# EAGLE design freesoc_1.0 (EAGLE 6.2)
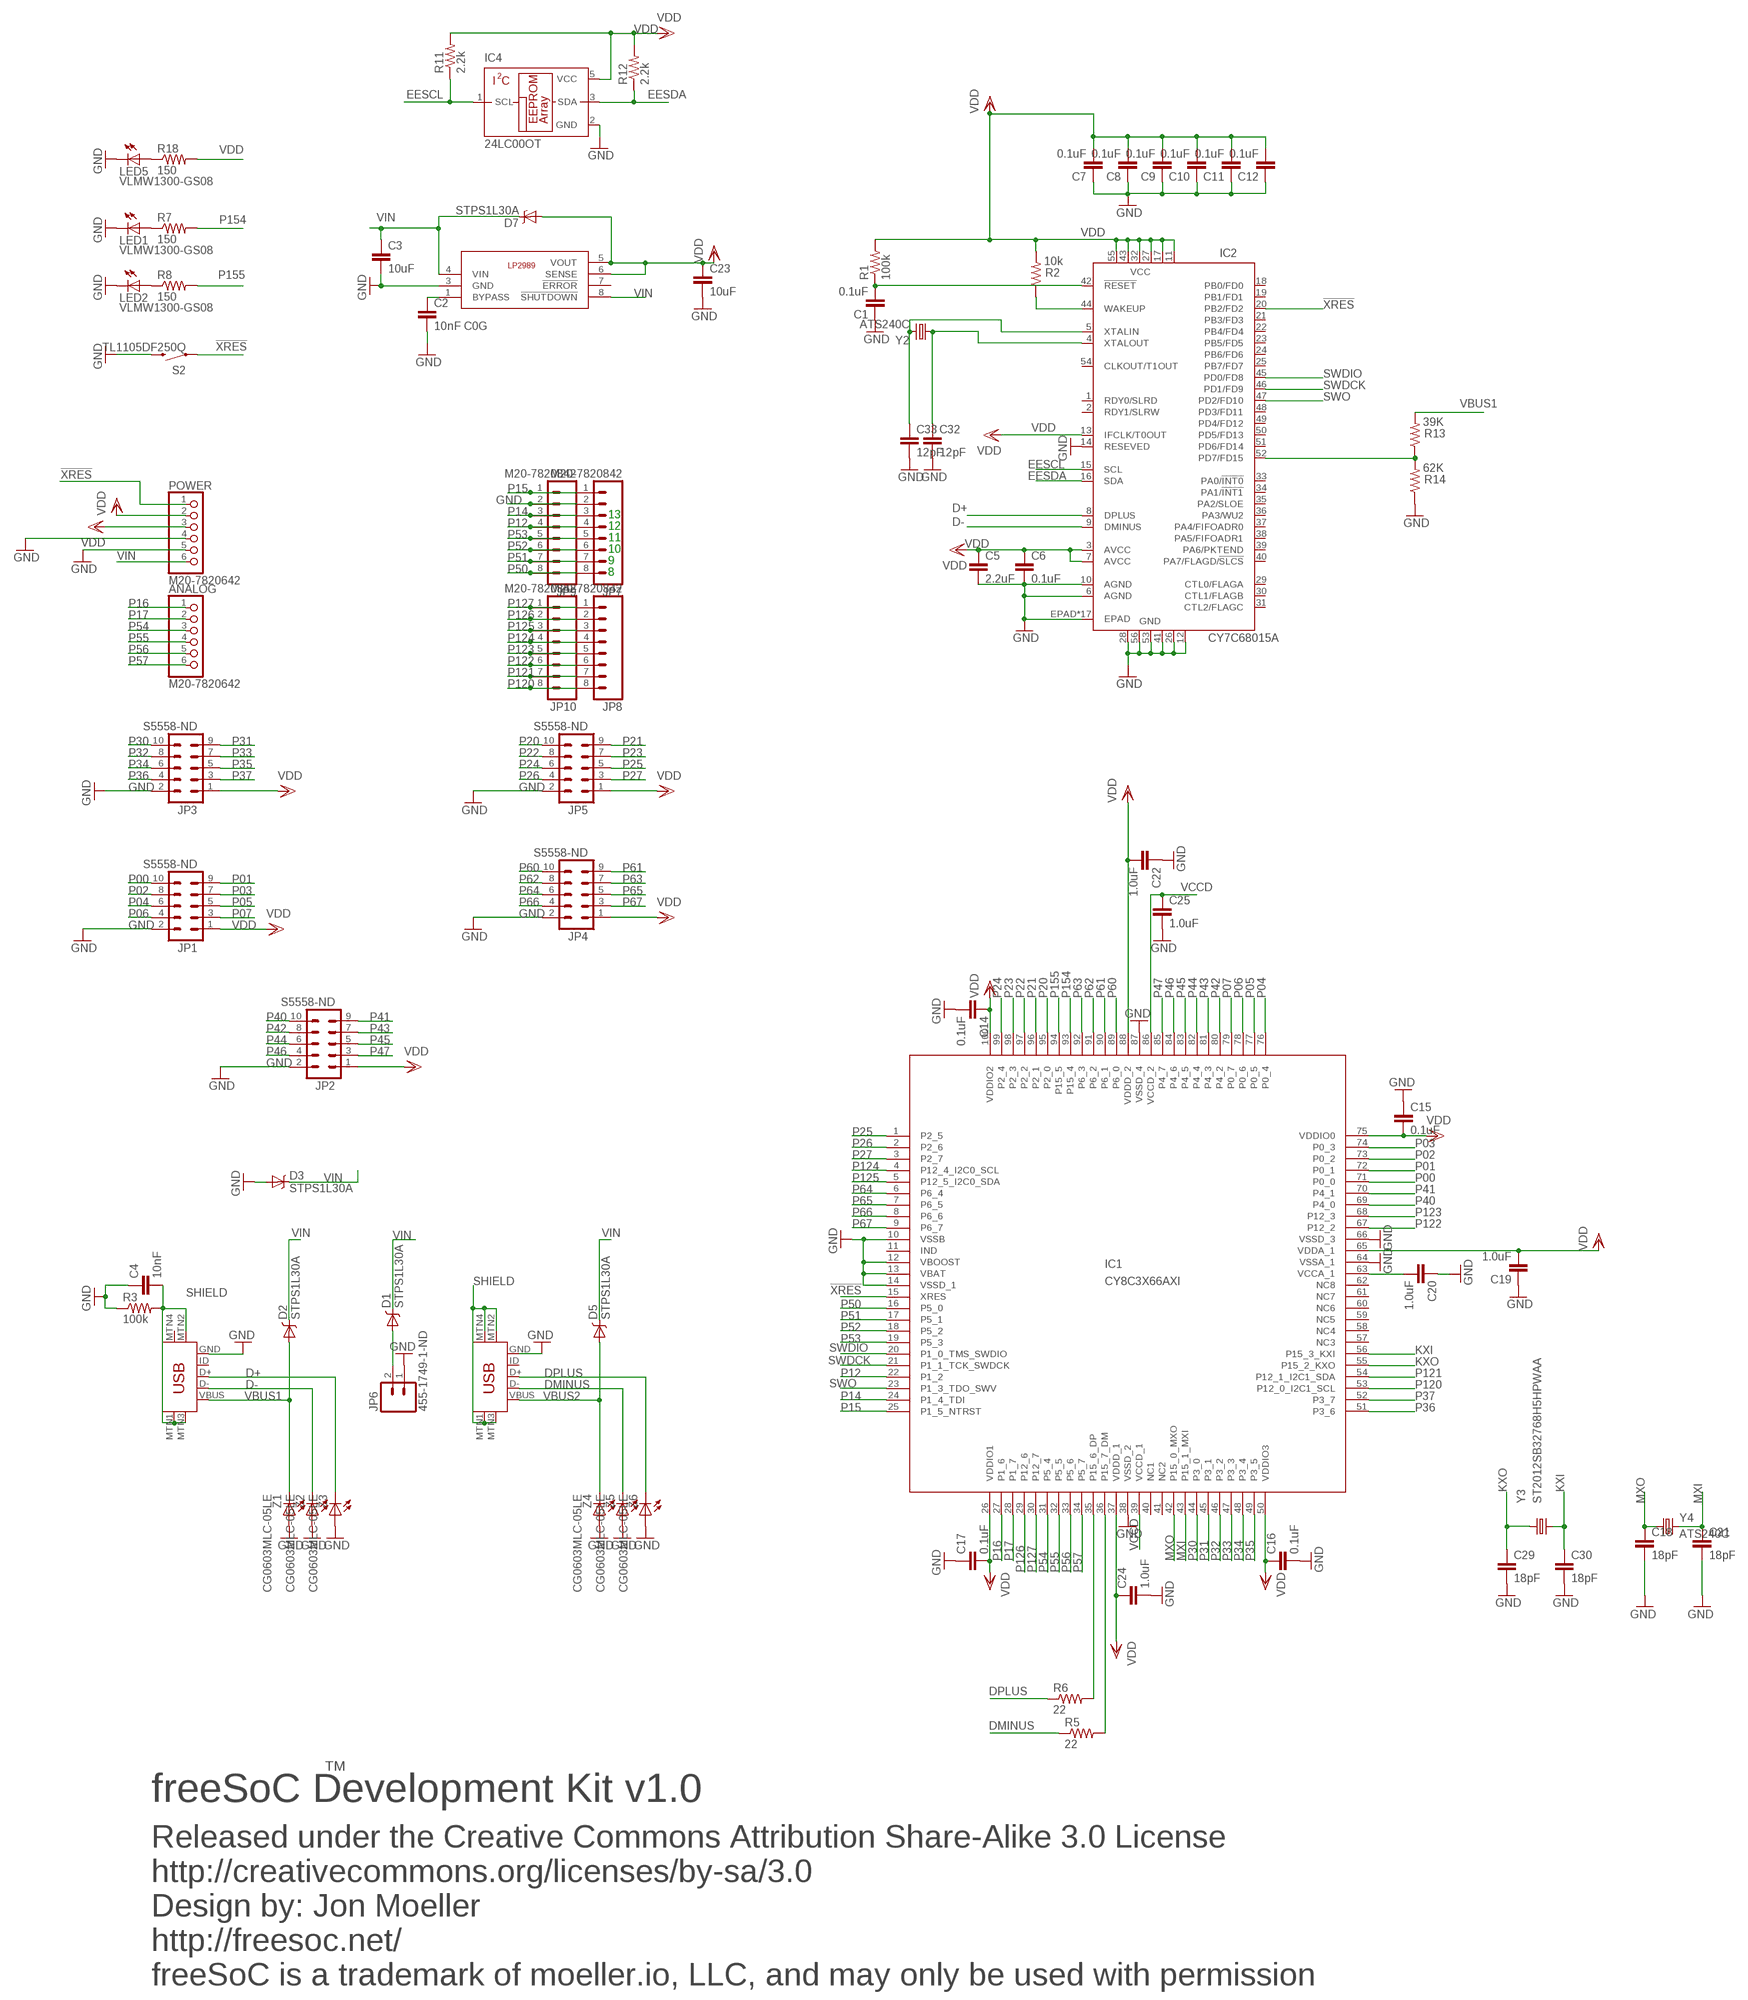
[diagram p0: schematic, sheet 1]

## Parts
ANALOG  M20-7820642  PINHD-1X6  [1X06]
C1  0.1uF  CAP0402-CAP  [0402-CAP]
C2  10nF C0G  CAP0402-CAP  [0402-CAP]
C3  10uF  CAP1206  [1206]
C4  10nF  CAP0402-CAP  [0402-CAP]
C5  2.2uF  CAP0603-CAP  [0603-CAP]
C6  0.1uF  CAP0402-CAP  [0402-CAP]
C7  0.1uF  CAP0402-CAP  [0402-CAP]
C8  0.1uF  CAP0402-CAP  [0402-CAP]
C9  0.1uF  CAP0402-CAP  [0402-CAP]
C10  0.1uF  CAP0402-CAP  [0402-CAP]
C11  0.1uF  CAP0402-CAP  [0402-CAP]
C12  0.1uF  CAP0402-CAP  [0402-CAP]
C14  0.1uF  CAP0402-CAP  [0402-CAP]
C15  0.1uF  CAP0402-CAP  [0402-CAP]
C16  0.1uF  CAP0402-CAP  [0402-CAP]
C17  0.1uF  CAP0402-CAP  [0402-CAP]
C18  18pF  CAP0402-CAP  [0402-CAP]
C19  1.0uF  CAP0402-CAP  [0402-CAP]
C20  1.0uF  CAP0402-CAP  [0402-CAP]
C21  18pF  CAP0402-CAP  [0402-CAP]
C22  1.0uF  CAP0402-CAP  [0402-CAP]
C23  10uF  CAP1206  [1206]
C24  1.0uF  CAP0402-CAP  [0402-CAP]
C25  1.0uF  CAP0402-CAP  [0402-CAP]
C29  18pF  CAP0402-CAP  [0402-CAP]
C30  18pF  CAP0402-CAP  [0402-CAP]
C32  12pF  CAP0402-CAP  [0402-CAP]
C33  12pF  CAP0402-CAP  [0402-CAP]
D1  STPS1L30A  DIODE-SCHOTTKY_  [SMA-DIODE]
D2  STPS1L30A  DIODE-SCHOTTKY_  [SMA-DIODE]
D3  STPS1L30A  DIODE-SCHOTTKY_  [SMA-DIODE]
D5  STPS1L30A  DIODE-SCHOTTKY_  [SMA-DIODE]
D7  STPS1L30A  DIODE-SCHOTTKY_  [SMA-DIODE]
IC1  CY8C3X66AXI  [TQFP-100]
IC2  CY7C68015A  CY7C68015A-56QFNLFXC  [QFN56]
IC4  24LC00OT  [SOT23-5L]
JP1  S5558-ND  M05X2RAF  [2X5-RAF]
JP2  S5558-ND  M05X2RAF  [2X5-RAF]
JP3  S5558-ND  M05X2RAF  [2X5-RAF]
JP4  S5558-ND  M05X2RAF  [2X5-RAF]
JP5  S5558-ND  M05X2RAF  [2X5-RAF]
JP6  455-1749-1-ND  M02-JST-2MM-SMT  [JST-2-SMD]
JP7  M20-7820842  M081X08  [1X08]
JP8  M20-7820842  M081X08  [1X08]
JP9  M20-7820842  M081X08  [1X08]
JP10  M20-7820842  M081X08  [1X08]
LED1  VLMW1300-GS08  LED0603  [LED-0603]
LED2  VLMW1300-GS08  LED0603  [LED-0603]
LED5  VLMW1300-GS08  LED0603  [LED-0603]
POWER  M20-7820642  PINHD-1X6  [1X06]
R1  100k  RESISTOR0402-RES  [0402-RES]
R2  10k  RESISTOR0402-RES  [0402-RES]
R3  100k  RESISTOR0402-RES  [0402-RES]
R5  22  RESISTOR0805-RES  [0805]
R6  22  RESISTOR0805-RES  [0805]
R7  150  RESISTOR0603-RES  [0603-RES]
R8  150  RESISTOR0603-RES  [0603-RES]
R11  2.2k  RESISTOR0402-RES  [0402-RES]
R12  2.2k  RESISTOR0402-RES  [0402-RES]
R13  39K  RESISTOR0402-RES  [0402-RES]
R14  62K  RESISTOR0402-RES  [0402-RES]
R18  150  RESISTOR0603-RES  [0603-RES]
S2  TL1105DF250Q  SWITCH-MOMENTARY-2PTH  [TACTILE-PTH]
U$1  LP2989  [SO08]
U$5  USB-MINIB-5PIN  [USB-MINIB]
U$6  USB-MINIB-5PIN  [USB-MINIB]
Y2  ATS240C  CRYSTALHC49US  [HC49US]
Y3  ST2012SB32768H5HPWAA  CRYSTALST2012B  [ST2012B]
Y4  ATS240C  CRYSTALHC49US  [HC49US]
Z1  CG0603MLC-05LE  LED0603  [LED-0603]
Z2  CG0603MLC-05LE  LED0603  [LED-0603]
Z3  CG0603MLC-05LE  LED0603  [LED-0603]
Z4  CG0603MLC-05LE  LED0603  [LED-0603]
Z5  CG0603MLC-05LE  LED0603  [LED-0603]
Z6  CG0603MLC-05LE  LED0603  [LED-0603]

## Nets
!XRES: IC1.15(XRES) IC2.20(PB2/FD2) POWER.1 S2.1
D+: IC2.8(DPLUS) U$5.D+ Z3.C
D-: IC2.9(DMINUS) U$5.D- Z2.C
DMINUS: R5.1 U$6.D- Z5.C
DPLUS: R6.1 U$6.D+ Z6.C
EESCL: IC2.15(SCL) IC4.1(SCL) R11.1
EESDA: IC2.16(SDA) IC4.3(SDA) R12.1
GND: C1.1 C2.2 C3.2 C4.1 C5.2 C6.2 C7.1 C8.1 C9.1 C10.1 C11.1 C12.1 C14.2 C15.1 C16.2 C17.1 C18.2 C19.1 C20.1 C21.2 C22.1 C23.2 C24.2 C25.2 C29.2 C30.2 C32.2 C33.2 D3.A IC1.10(VSSB) IC1.12(VBOOST) IC1.13(VBAT) IC1.14(VSSD_1) IC1.38(VSSD_2) IC1.64(VSSA_1) IC1.66(VSSD_3) IC1.87(VSSD_4) IC2.6(AGND) IC2.10(AGND) IC2.12(GND) IC2.14(RESEVED) IC2.26(GND) IC2.28(GND) IC2.41(GND) IC2.53(GND) IC2.56(GND) IC2.EPAD IC2.P$1(EPAD) IC2.P$2(EPAD) IC2.P$3(EPAD) IC2.P$4(EPAD) IC2.P$5(EPAD) IC2.P$6(EPAD) IC2.P$7(EPAD) IC2.P$8(EPAD) IC2.P$9(EPAD) IC2.P$10(EPAD) IC2.P$11(EPAD) IC2.P$12(EPAD) IC2.P$13(EPAD) IC2.P$14(EPAD) IC2.P$15(EPAD) IC2.P$16(EPAD) IC4.2(GND) JP1.2 JP2.2 JP3.2 JP4.2 JP5.2 JP6.1 JP7.2 JP9.2 LED1.C LED2.C LED5.C POWER.4 POWER.5 R3.1 R14.1 S2.3 U$1.3(GND) U$5.GND U$6.GND Z1.A Z2.A Z3.A Z4.A Z5.A Z6.A
KXI: C30.1 IC1.56(P15_3_KXI) Y3.P$2
KXO: C29.1 IC1.55(P15_2_KXO) Y3.P$1
MXI: C21.1 IC1.43(P15_1_MXI) Y4.2
MXO: C18.1 IC1.42(P15_0_MXO) Y4.1
N$1: C1.2 IC2.42(!RESET) R1.1
N$2: D1.A JP6.2
N$5: IC2.44(WAKEUP) R2.1
N$7: C20.2 IC1.63(VCCA_1)
N$8: IC1.35(P15_6_DP) R6.2
N$9: IC1.36(P15_7_DM) R5.2
N$11: LED1.A R7.1
N$12: LED2.A R8.1
N$13: C2.1 U$1.1(BYPASS)
N$15: IC2.52(PD7/FD15) R13.1 R14.2
N$18: LED5.A R18.1
P00: IC1.71(P0_0) JP1.10
P01: IC1.72(P0_1) JP1.9
P02: IC1.73(P0_2) JP1.8
P03: IC1.74(P0_3) JP1.7
P04: IC1.76(P0_4) JP1.6
P05: IC1.77(P0_5) JP1.5
P06: IC1.78(P0_6) JP1.4
P07: IC1.79(P0_7) JP1.3
P12: IC1.22(P1_2) JP7.4 JP9.4
P14: IC1.24(P1_4_TDI) JP7.3 JP9.3
P15: IC1.25(P1_5_NTRST) JP7.1 JP9.1
P16: ANALOG.1 IC1.27(P1_6)
P17: ANALOG.2 IC1.28(P1_7)
P20: IC1.95(P2_0) JP5.10
P21: IC1.96(P2_1) JP5.9
P22: IC1.97(P2_2) JP5.8
P23: IC1.98(P2_3) JP5.7
P24: IC1.99(P2_4) JP5.6
P25: IC1.1(P2_5) JP5.5
P26: IC1.2(P2_6) JP5.4
P27: IC1.3(P2_7) JP5.3
P30: IC1.44(P3_0) JP3.10
P31: IC1.45(P3_1) JP3.9
P32: IC1.46(P3_2) JP3.8
P33: IC1.47(P3_3) JP3.7
P34: IC1.48(P3_4) JP3.6
P35: IC1.49(P3_5) JP3.5
P36: IC1.51(P3_6) JP3.4
P37: IC1.52(P3_7) JP3.3
P40: IC1.69(P4_0) JP2.10
P41: IC1.70(P4_1) JP2.9
P42: IC1.80(P4_2) JP2.8
P43: IC1.81(P4_3) JP2.7
P44: IC1.82(P4_4) JP2.6
P45: IC1.83(P4_5) JP2.5
P46: IC1.84(P4_6) JP2.4
P47: IC1.85(P4_7) JP2.3
P50: IC1.16(P5_0) JP7.8 JP9.8
P51: IC1.17(P5_1) JP7.7 JP9.7
P52: IC1.18(P5_2) JP7.6 JP9.6
P53: IC1.19(P5_3) JP7.5 JP9.5
P54: ANALOG.3 IC1.31(P5_4)
P55: ANALOG.4 IC1.32(P5_5)
P56: ANALOG.5 IC1.33(P5_6)
P57: ANALOG.6 IC1.34(P5_7)
P60: IC1.89(P6_0) JP4.10
P61: IC1.90(P6_1) JP4.9
P62: IC1.91(P6_2) JP4.8
P63: IC1.92(P6_3) JP4.7
P64: IC1.6(P6_4) JP4.6
P65: IC1.7(P6_5) JP4.5
P66: IC1.8(P6_6) JP4.4
P67: IC1.9(P6_7) JP4.3
P120: IC1.53(P12_0_I2C1_SCL) JP8.8 JP10.8
P121: IC1.54(P12_1_I2C1_SDA) JP8.7 JP10.7
P122: IC1.67(P12_2) JP8.6 JP10.6
P123: IC1.68(P12_3) JP8.5 JP10.5
P124: IC1.4(P12_4_I2C0_SCL) JP8.4 JP10.4
P125: IC1.5(P12_5_I2C0_SDA) JP8.3 JP10.3
P126: IC1.29(P12_6) JP8.2 JP10.2
P127: IC1.30(P12_7) JP8.1 JP10.1
P154: IC1.93(P15_4) R7.2
P155: IC1.94(P15_5) R8.2
SHIELD: C4.2 R3.2 U$5.MTN1(MTN2) U$5.MTN2(MTN3) U$5.MTN3(MTN1) U$6.MTN1(MTN2) U$6.MTN2(MTN3) U$6.MTN3(MTN1) U$6.MTN4
SWDCK: IC1.21(P1_1_TCK_SWDCK) IC2.46(PD1/FD9)
SWDIO: IC1.20(P1_0_TMS_SWDIO) IC2.45(PD0/FD8)
SWO: IC1.23(P1_3_TDO_SWV) IC2.47(PD2/FD10)
VBUS1: D2.A R13.2 U$5.VBUS Z1.C
VBUS2: D5.A U$6.VBUS Z4.C
VCCD: C25.1 IC1.39(VCCD_1) IC1.86(VCCD_2)
VDD: C5.1 C6.1 C7.2 C8.2 C9.2 C10.2 C11.2 C12.2 C14.1 C15.2 C16.1 C17.2 C19.2 C22.2 C23.1 C24.1 D7.A IC1.26(VDDIO1) IC1.37(VDDD_1) IC1.50(VDDIO3) IC1.65(VDDA_1) IC1.75(VDDIO0) IC1.88(VDDD_2) IC1.100(VDDIO2) IC2.3(AVCC) IC2.7(AVCC) IC2.11(VCC) IC2.13(IFCLK/T0OUT) IC2.17(VCC) IC2.27(VCC) IC2.32(VCC) IC2.43(VCC) IC2.55(VCC) IC4.5(VCC) JP1.1 JP2.1 JP3.1 JP4.1 JP5.1 POWER.2 POWER.3 R1.2 R2.2 R11.2 R12.2 R18.2 U$1.5(VOUT) U$1.6(SENSE)
VIN: C3.1 D1.C D2.C D3.C D5.C D7.C POWER.6 U$1.4(VIN) U$1.8(!SHUTDOWN)
XIN: C33.1 IC2.5(XTALIN) Y2.2
XOUT: C32.1 IC2.4(XTALOUT) Y2.1
Unconnected: IC1.11(IND) IC1.40(NC1) IC1.41(NC2) IC1.57(NC3) IC1.58(NC4) IC1.59(NC5) IC1.60(NC6) IC1.61(NC7) IC1.62(NC8) IC2.1(RDY0/SLRD) IC2.2(RDY1/SLRW) IC2.18(PB0/FD0) IC2.19(PB1/FD1) IC2.21(PB3/FD3) IC2.22(PB4/FD4) IC2.23(PB5/FD5) IC2.24(PB6/FD6) IC2.25(PB7/FD7) IC2.29(CTL0/FLAGA) IC2.30(CTL1/FLAGB) IC2.31(CTL2/FLAGC) IC2.33(PA0/!INT0) IC2.34(PA1/!INT1) IC2.35(PA2/SLOE) IC2.36(PA3/WU2) IC2.37(PA4/FIFOADR0) IC2.38(PA5/FIFOADR1) IC2.39(PA6/PKTEND) IC2.40(PA7/FLAGD/!SLCS) IC2.48(PD3/FD11) IC2.49(PD4/FD12) IC2.50(PD5/FD13) IC2.51(PD6/FD14) IC2.54(CLKOUT/T1OUT) U$1.7(!ERROR) U$5.ID U$5.MTN4 U$6.ID

## Notes on the sheet
- 13
- 12
- 11
- 10
- 9
- 8
- TM
- freeSoC Development Kit v1.0
- Released under the Creative Commons Attribution Share-Alike 3.0 License
- http://creativecommons.org/licenses/by-sa/3.0
- Design by: Jon Moeller
- http://freesoc.net/
- freeSoC is a trademark of moeller.io, LLC, and may only be used with permission

## Library data of the parts
ANALOG POWER = pinhead:PINHD-1X6: PIN HEADER
C1-C12 C14-C25 C29 C30 C32 C33 = SparkFun:CAP: Capacitor Standard 0603 ceramic capacitor, and 0.1" leaded capacitor.
D1-D3 D5 D7 = SparkFun:DIODE-SCHOTTKY
IC1 = PSoC3:CY8C3X66AXI: CY8C_pins edit this description Auto generated by make-symbol-device-package-bsdl.ulp Rev. 34 Source: CY8C_pins.txt
IC2 = cypress:CY7C6801*A-56QFN: EZ-USB FX2LP (TM) USB Microcontroller Source: http://www.cypress.com .. cy7c68013a_5.pdf
IC4 = microchip:24*00: Serial EEPROM 128 bit, I2C (AA = 1.8 V/LC = 2.5 V/C = 5.0 V)
JP1-JP5 = SparkFun:M05X2: Header 5x2 Standard 10-pin dual row 0.1" header. Commonly used with AVR-ISP. Use with Spark Fun Electronics SKU: PRT-00778
JP6 = SparkFun:M02: Header 2 Standard 2-pin 0.1" header. Use with straight break away headers (SKU : PRT-00116), right angle break away headers (PRT-00553), swiss pins (PRT-00743), machine pins (PRT-00117), and female headers (PRT-00115). Molex polarized connector foot print use with SKU : PRT-08233 with associated crimp pins and housings.
JP7-JP10 = SparkFun:M08: Header 8 Standard 8-pin 0.1" header. Use with straight break away headers (SKU : PRT-00116), right angle break away headers (PRT-00553), swiss pins (PRT-00743), machine pins (PRT-00117), and female headers (PRT-00115).
LED1 LED2 LED5 Z1-Z6 = SparkFun:LED: LEDs Standard schematic elements and footprints for 5mm, 3mm, 1206, and 0603 sized LEDs. 5mm - Spark Fun Electronics SKU : COM-00529 (and others)
R1-R3 R5-R8 R11-R14 R18 = SparkFun:RESISTOR: Resistor Basic schematic elements and footprints for 0603, 1206, and PTH resistors.
S2 = SparkFun:SWITCH-MOMENTARY-2
U$1 = SparkFun:LP2989
U$5 U$6 = SparkFun:USB-MINIB: Mini-USB "B" connector with 5th pin broken out. Created new symbol breaking out 5th "ID" pin in mini/micro USB connector spec. See: http://en.wikipedia.org/wiki/Mini_usb#Cables. Uses same footprint as 4-pin symbol. Also added pins to connect to mounting / shield pads if required (probably not generally needed as signals aren't shielded once they leave the connector).
Y2-Y4 = SparkFun:CRYSTAL: Crystals Various standard crystals. Proven footprints. Spark Fun Electronics SKU : COM-00534

## Board
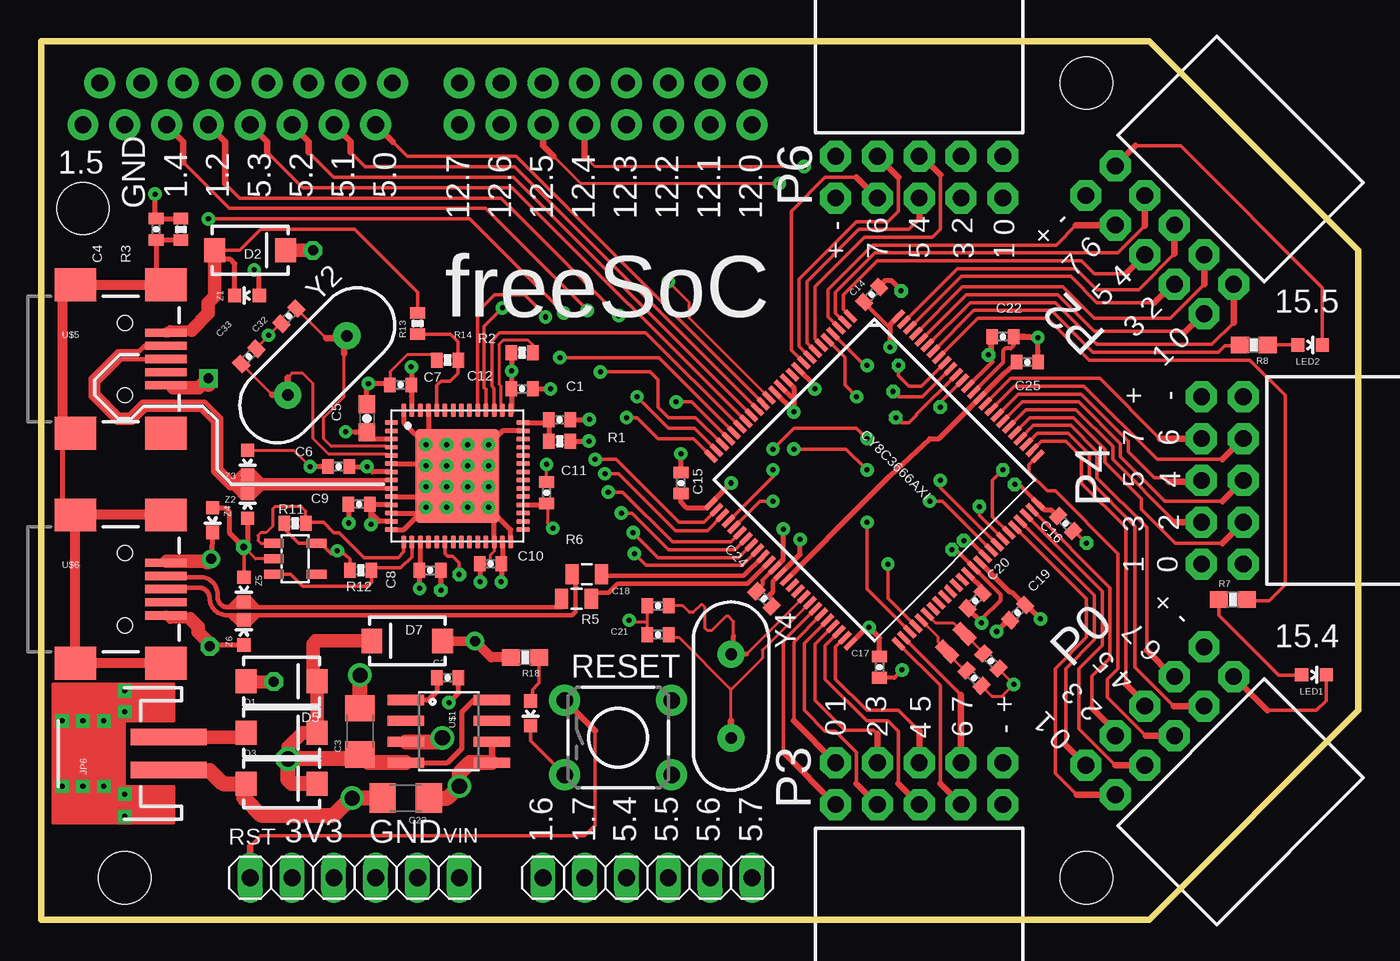
[diagram p1: board, top side]
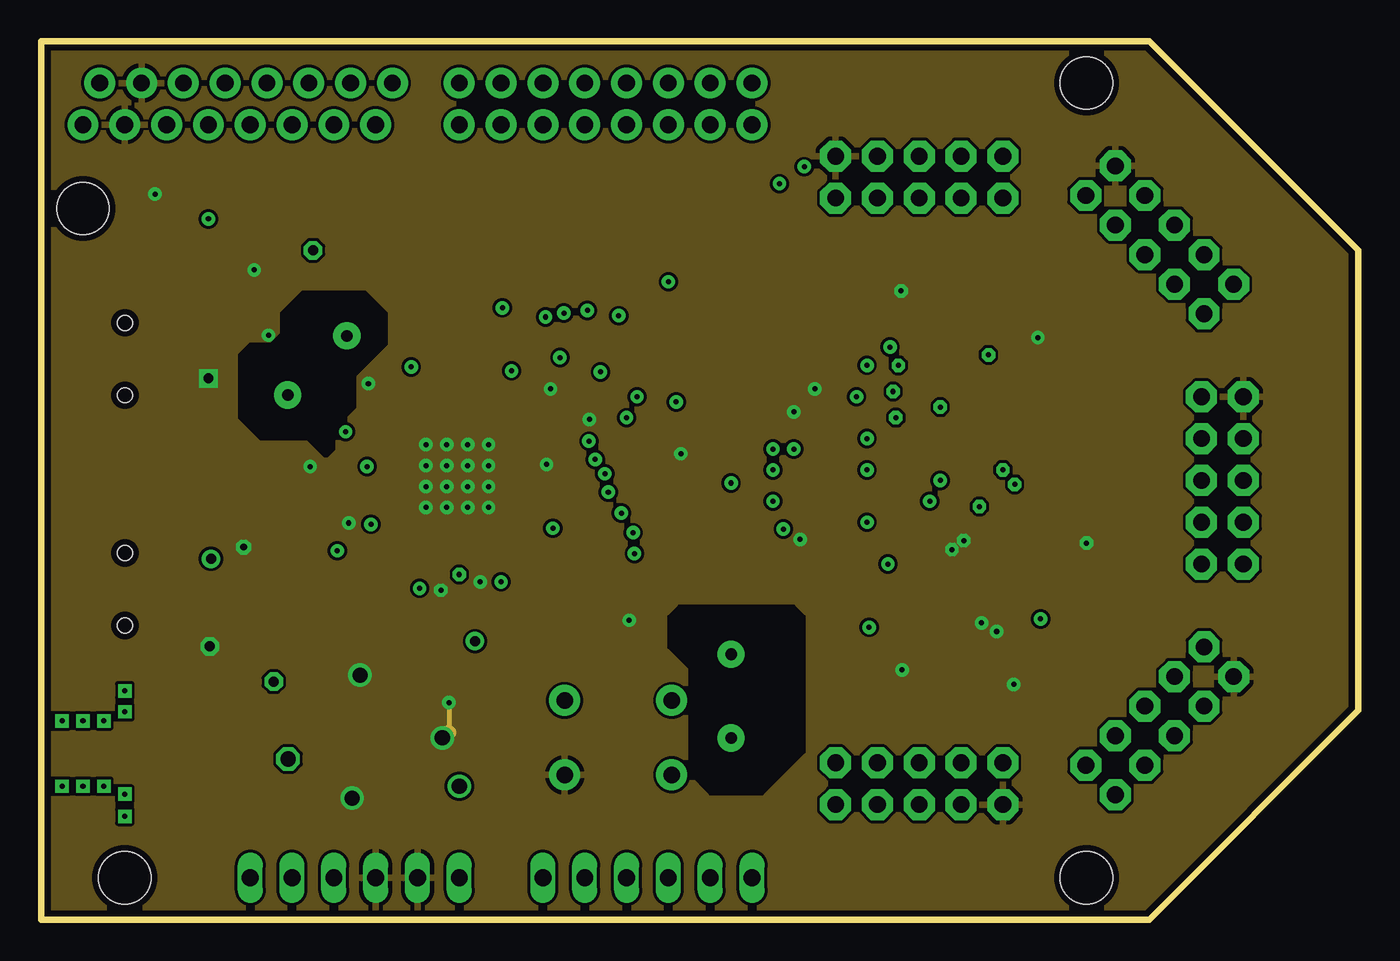
[diagram p2: board, inner layer Route2]
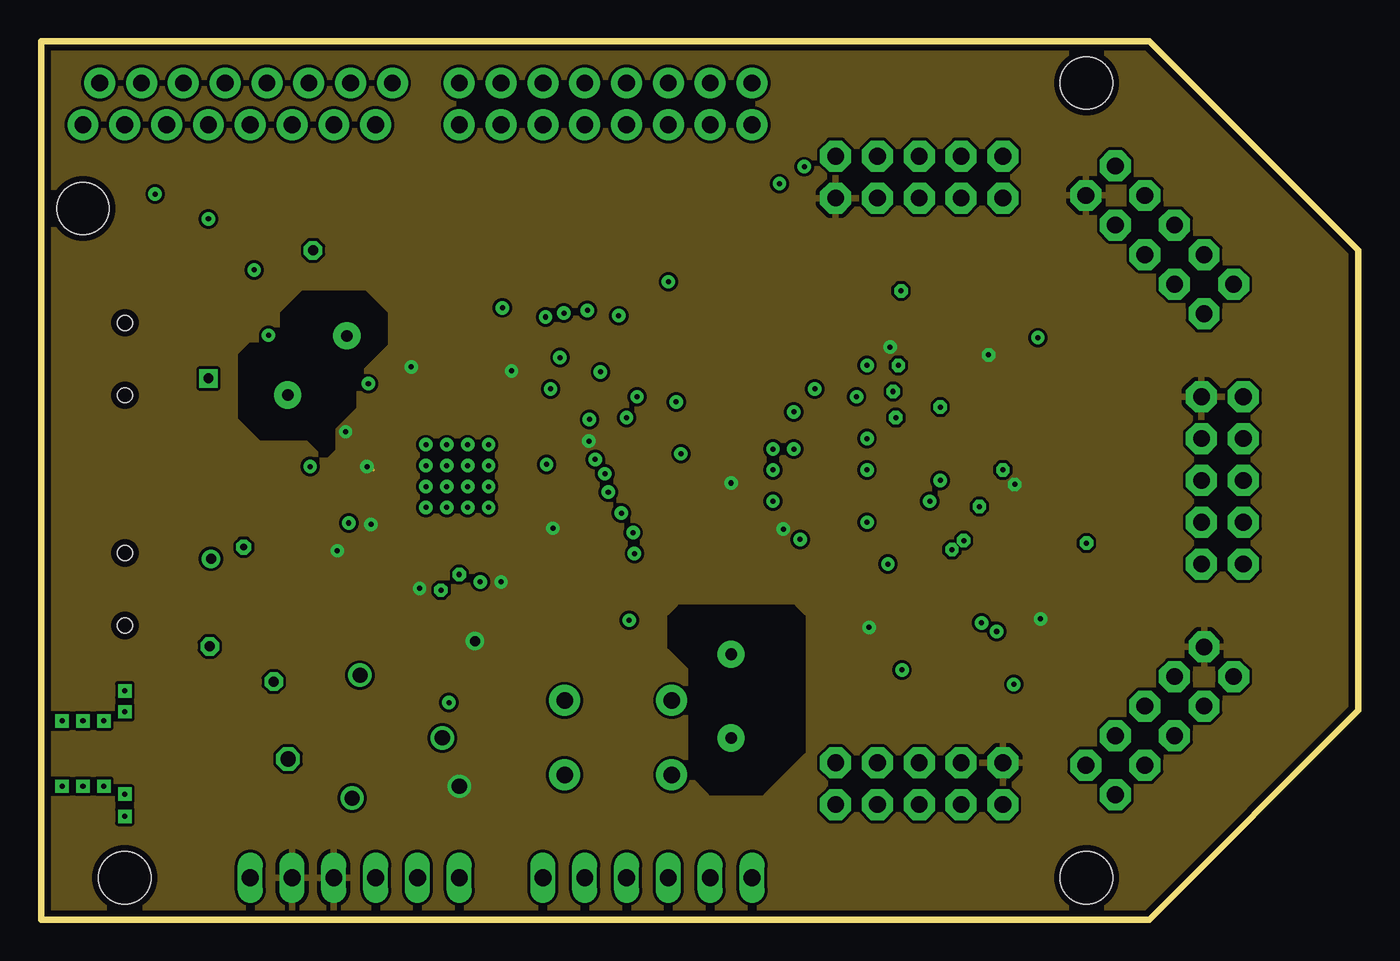
[diagram p3: board, inner layer Route15]
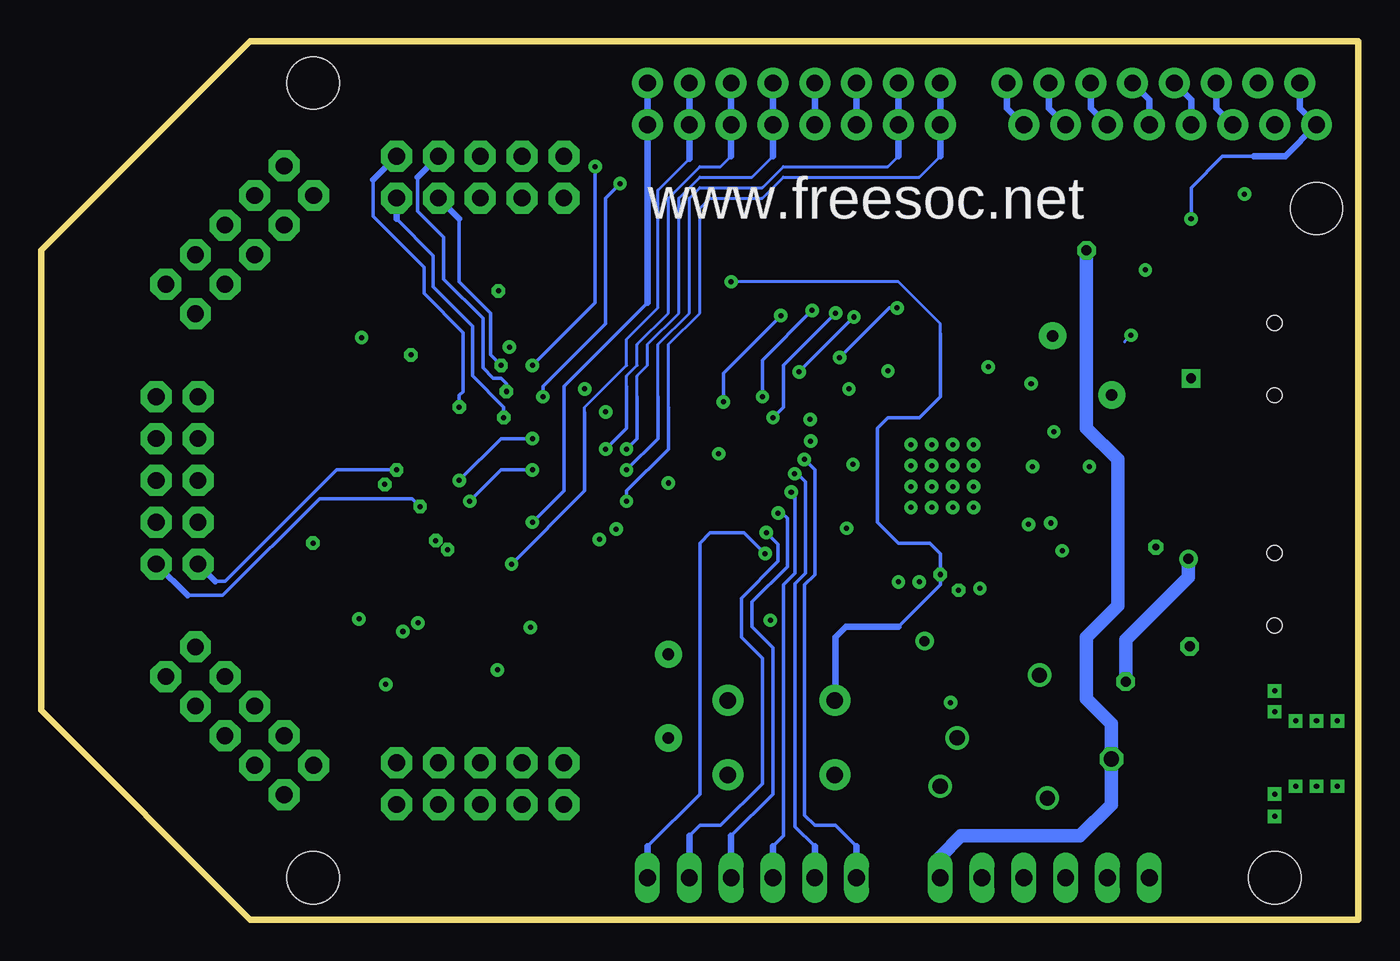
[diagram p4: board, bottom side, seen from below]

Size 80.01 x 53.34 mm. Coordinates in mm from the lower left corner, seen from the top.
Outline: 0,0 67.31,0 80.01,12.7 80.01,40.64 67.31,53.34 0,53.34 0,0
Copper layers (1*2*15*16): Top 0.035mm / dielectric 0.2mm / Route2 0.035mm / dielectric 0.15mm / Route15 0.035mm / dielectric 0.2mm / Bottom 0.035mm
Design rules: minimum track width 7mil, minimum drill 12mil, track to track 7mil, track to pad 7mil, pad to pad 7mil, via to via 7mil, smd to smd 7mil, copper to edge 15mil, drill to drill 12mil, minimum pad ring 10mil, minimum via ring 10mil, stop-mask expansion 2mil, vias tented up to drill 12mil, thermal gap 10mil
Holes 3.17 mm at 63.5,2.54 63.5,50.8 2.54,43.18 5.08,2.54

### Footprints (pad centres in the part's own frame; a part is rotated, then mirrored left to right if it is on the bottom)
1X06 = drill 1.016 long: 1 -6.35,0; 2 -3.81,0; 3 -1.27,0; 4 1.27,0; 5 3.81,0; 6 6.35,0
0402-CAP = smd 0.7 x 0.9: 1 -0.65,0; 2 0.65,0
1206 = smd 1.6 x 1.8: 1 -1.4,0; 2 1.4,0
0603-CAP = smd 1.1 x 1: 1 -0.85,0; 2 0.85,0
SMA-DIODE = smd 1.27 x 1.47: A -2.15,0; C 2.15,0
TQFP-100 = smd 0.9 x 0.3: 1 -8.05,6; 2 -8.05,5.5; 3 -8.05,5; 4 -8.05,4.5; 5 -8.05,4; 6 -8.05,3.5; 7 -8.05,3; 8 -8.05,2.5; 9 -8.05,2; 10 -8.05,1.5; 11 -8.05,1; 12 -8.05,0.5; 13 -8.05,0; 14 -8.05,-0.5; 15 -8.05,-1; 16 -8.05,-1.5; 17 -8.05,-2; 18 -8.05,-2.5; 19 -8.05,-3; 20 -8.05,-3.5; 21 -8.05,-4; 22 -8.05,-4.5; 23 -8.05,-5; 24 -8.05,-5.5; 25 -8.05,-6; 51 8.05,-6; 52 8.05,-5.5; 53 8.05,-5; 54 8.05,-4.5; 55 8.05,-4; 56 8.05,-3.5; 57 8.05,-3; 58 8.05,-2.5; 59 8.05,-2; 60 8.05,-1.5; 61 8.05,-1; 62 8.05,-0.5; 63 8.05,0; 64 8.05,0.5; 65 8.05,1; 66 8.05,1.5; 67 8.05,2; 68 8.05,2.5; 69 8.05,3; 70 8.05,3.5; 71 8.05,4; 72 8.05,4.5; 73 8.05,5; 74 8.05,5.5; 75 8.05,6 | smd 0.3 x 0.9: 26 -6,-8.05; 27 -5.5,-8.05; 28 -5,-8.05; 29 -4.5,-8.05; 30 -4,-8.05; 31 -3.5,-8.05; 32 -3,-8.05; 33 -2.5,-8.05; 34 -2,-8.05; 35 -1.5,-8.05; 36 -1,-8.05; 37 -0.5,-8.05; 38 0,-8.05; 39 0.5,-8.05; 40 1,-8.05; 41 1.5,-8.05; 42 2,-8.05; 43 2.5,-8.05; 44 3,-8.05; 45 3.5,-8.05; 46 4,-8.05; 47 4.5,-8.05; 48 5,-8.05; 49 5.5,-8.05; 50 6,-8.05; 76 6,8.05; 77 5.5,8.05; 78 5,8.05; 79 4.5,8.05; 80 4,8.05; 81 3.5,8.05; 82 3,8.05; 83 2.5,8.05; 84 2,8.05; 85 1.5,8.05; 86 1,8.05; 87 0.5,8.05; 88 0,8.05; 89 -0.5,8.05; 90 -1,8.05; 91 -1.5,8.05; 92 -2,8.05; 93 -2.5,8.05; 94 -3,8.05; 95 -3.5,8.05; 96 -4,8.05; 97 -4.5,8.05; 98 -5,8.05; 99 -5.5,8.05; 100 -6,8.05
QFN56 = smd 0.8 x 0.3: 1 -4,3.25; 2 -4,2.75; 3 -4,2.25; 4 -4,1.75; 5 -4,1.25; 6 -4,0.75; 7 -4,0.25; 8 -4,-0.25; 9 -4,-0.75; 10 -4,-1.25; 11 -4,-1.75; 12 -4,-2.25; 13 -4,-2.75; 14 -4,-3.25; 29 4,-3.25; 30 4,-2.75; 31 4,-2.25; 32 4,-1.75; 33 4,-1.25; 34 4,-0.75; 35 4,-0.25; 36 4,0.25; 37 4,0.75; 38 4,1.25; 39 4,1.75; 40 4,2.25; 41 4,2.75; 42 4,3.25 | smd 0.3 x 0.8: 15 -3.25,-4; 16 -2.75,-4; 17 -2.25,-4; 18 -1.75,-4; 19 -1.25,-4; 20 -0.75,-4; 21 -0.25,-4; 22 0.25,-4; 23 0.75,-4; 24 1.25,-4; 25 1.75,-4; 26 2.25,-4; 27 2.75,-4; 28 3.25,-4; 43 3.25,4; 44 2.75,4; 45 2.25,4; 46 1.75,4; 47 1.25,4; 48 0.75,4; 49 0.25,4; 50 -0.25,4; 51 -0.75,4; 52 -1.25,4; 53 -1.75,4; 54 -2.25,4; 55 -2.75,4; 56 -3.25,4 | smd 5.1 x 5.7: EPAD 0,0 | drill 0.305: P$1 0.635,-0.635; P$2 0.635,0.635; P$3 1.905,0.635; P$4 1.905,1.905; P$5 0.635,1.905; P$6 -0.635,1.905; P$7 -1.905,1.905; P$8 -1.905,0.635; P$9 -0.635,0.635; P$10 -0.635,-0.635; P$11 -1.905,-0.635; P$12 -1.905,-1.905; P$13 -0.635,-1.905; P$14 0.635,-1.905; P$15 1.905,-1.905; P$16 1.905,-0.635
SOT23-5L = smd 0.55 x 1.2: 1 -0.95,-1.3; 2 0,-1.3; 3 0.95,-1.3; 4 0.95,1.3; 5 -0.95,1.3
2X5-RAF = drill 1.016 pad 1.88 octagon: 1 -1.27,5.08; 2 1.27,5.08; 3 -1.27,2.54; 4 1.27,2.54; 5 -1.27,0; 6 1.27,0; 7 -1.27,-2.54; 8 1.27,-2.54; 9 -1.27,-5.08; 10 1.27,-5.08
JST-2-SMD = smd 1 x 4.6: 1 -1,-3.7; 2 1,-3.7
1X08 = drill 1.016 pad 1.88: 1 0,0; 2 2.54,0; 3 5.08,0; 4 7.62,0; 5 10.16,0; 6 12.7,0; 7 15.24,0; 8 17.78,0
LED-0603 = smd 0.8 x 0.8: A 0,-0.75; C 0,0.75
0402-RES = smd 0.7 x 0.9: 1 -0.65,0; 2 0.65,0
0805 = smd 0.8 x 1.2: 1 -0.9,0; 2 0.9,0
0603-RES = smd 1.1 x 1: 1 -0.85,0; 2 0.85,0
TACTILE-PTH = drill 1.016 pad 1.88: 1 -3.251,2.261; 2 3.251,2.261; 3 -3.251,-2.261; 4 3.251,-2.261
SO08 = smd 0.61 x 2.21: 1 -1.905,-2.616; 2 -0.635,-2.616; 3 0.635,-2.616; 4 1.905,-2.616; 5 1.905,2.616; 6 0.635,2.616; 7 -0.635,2.616; 8 -1.905,2.616
USB-MINIB = smd 2.5 x 0.5: D+ 2.5,0; D- 2.5,0.8; GND 2.5,-1.6; ID 2.5,-0.8; VBUS 2.5,1.6 | smd 2.5 x 2: MTN1 -3,4.5; MTN2 2.5,4.5; MTN3 -3,-4.5; MTN4 2.5,-4.5 | hole 0.9: 0,2.2; 0,-2.2
HC49US = drill 0.7 pad 1.651: 1 -2.54,0; 2 2.54,0
ST2012B = smd 0.7 x 1.4: P$1 -0.75,0; P$2 0.75,0

### Placement (x,y rotation side)
ANALOG  36.83,2.54 0 top
C1  31.5,30.35 180 top
C2  24.69,14.68 0 top
C3  19.37,11.43 90 top
C4  6.98,41.91 270 top
C5  19.8,30.43 90 top
C6  18.07,27.51 180 top
C7  21.84,32.46 0 top
C8  23.62,21.21 180 top
C9  19.32,25.23 0 top
C10  27.3,21.61 0 top
C11  30.7,25.91 270 top
C12  29.21,32.23 180 top
C14  50.45,37.95 45 top
C15  38.86,26.51 270 top
C16  62.23,24.05 315 top
C17  50.93,15.34 90 top
C18  37.46,19.05 180 top
C19  59.31,18.64 45 top
C20  56.74,19.37 45 top
C21  37.46,17.3 180 top
C22  58.42,35.4 180 top
C23  22.15,7.38 180 top
C24  43.91,19.48 315 top
C25  59.91,33.86 0 top
C29  56.67,14.66 315 top
C30  57.7,15.7 315 top
C32  15.05,36.64 225 top
C33  12.61,34.2 45 top
D1  14.6,11.35 0 top
D2  12.7,40.64 0 top
D3  14.6,8.25 0 top
D5  14.6,14.48 0 top
D7  22.24,16.92 180 top
IC1  50.61,26.7 315 top
IC2  25.27,26.93 0 top
IC4  15.43,21.91 270 top
JP1  67.94,12.07 315 top
JP2  71.75,26.67 0 top
JP3  53.34,8.25 270 top
JP4  53.34,45.09 90 top
JP5  67.94,41.27 45 top
JP6  4.05,10.08 90 top
JP7  3.56,50.8 0 top
JP8  25.4,50.8 0 top
JP9  2.54,48.26 0 top
JP10  25.4,48.26 0 top
LED1  77.31,14.86 270 top
LED2  77.07,34.89 270 top
LED5  29.73,12.53 180 top
POWER  19.05,2.54 0 top
R1  31.5,29.05 0 top
R2  29.21,34.42 180 top
R3  8.49,41.91 270 top
R5  32.51,19.48 0 top
R6  33.15,20.97 0 top
R7  72.39,19.43 0 top
R8  73.66,34.89 180 top
R11  15.43,24.07 180 top
R12  19.42,21.21 180 top
R13  22.86,36.2 90 top
R14  24.69,33.97 0 top
R18  29.4,15.92 180 top
S2  35.05,11.05 0 top
U$1  24.77,11.43 270 top
U$5  5.08,34.04 0 top
U$6  5.08,20.07 0 top
Y2  16.77,33.66 225 top
Y3  55.56,16.82 45 top
Y4  41.91,13.57 270 top
Z1  12.51,37.9 90 top
Z2  12.54,25.12 0 top
Z3  12.54,27.75 180 top
Z4  10.41,24.25 180 top
Z5  12.32,20.05 180 top
Z6  12.32,17.42 0 top

### Tracks (layer width: path | path; a pad name or v marks a point on that pad's centre or on a via)
!XRES  (via drill 0.3)
  Top 0.178: v38.1,38.73 39.37,37.47 39.37,36.53 IC1.15
  Top 0.203: v25.4,20.96 25.4,21.67 25,22.07 24.69,22.07 24.53,22.23 24.53,23.1 24.52,23.1 IC2.20 | 12.7,4.45 13.34,5.08 33.02,5.08 33.66,5.72 33.66,11.45
  Top 0.406: POWER.1 12.7,4.45 | 33.66,11.45 S2.1
  Bottom 0.178: 25.4,35.56 25.4,36.2 27.94,38.73 v38.1,38.73
  Bottom 0.203: 25.4,35.56 25.4,31.75 26.67,30.48 28.58,30.48 29.21,29.84 29.21,24.13 27.94,22.86 26.03,22.86 25.4,22.23 v25.4,20.96 25.4,20.32 27.94,17.78 | S2.1 31.77,13.31 31.75,13.34
  Bottom 0.406: 27.94,17.78 31.12,17.78 31.75,17.14 31.75,13.34
D+
  Top 0.203: 7.7,34.04 U$5.D+ | 12.54,26.68 Z3.C 12.54,27.3 | 11.83,26.67 11.91,26.67 | 11.83,26.67 11.59,26.67 12.22,27.3 12.54,27.3 | 11.83,26.67 12.3,27.15 | 12.54,27.3 12.86,27.3 13.49,26.67 13.26,26.67 12.86,27.07 12.86,26.91 13.02,26.75
  Top 0.279: IC2.8 12.54,26.68 11.62,26.68 10.92,27.38 10.92,30.43 9.92,31.43 6.13,31.43 5.36,30.66 4.75,30.66 3.48,31.95 3.48,32.64 4.88,34.04 7.7,34.04
D-
  Top 0.203: 7.69,34.85 U$5.D- | 11.75,26.04 12.22,25.56 | 12.22,25.56 12.22,25.8 11.83,26.19 11.99,26.19 | 11.99,26.19 12.22,25.96 | 11.99,26.19 12.21,26.19 Z2.C 12.71,25.87 12.86,25.72 13.02,25.88 | 13.49,26.19 12.86,25.56 12.22,25.56 | 13.26,26.11 13.02,25.88 | 13.02,25.88 13.02,26.04 | 11.75,26.04 11.59,26.19 11.47,26.19 11.46,26.18 | 11.75,26.04 11.91,26.04
  Top 0.279: IC2.9 11.46,26.18 10.44,27.2 10.44,30.2 9.68,30.96 6.35,30.96 5.56,30.16 4.6,30.16 4.09,30.65 3,31.74 3,32.87 4.65,34.52 5.97,34.52 6.3,34.85 7.69,34.85
DMINUS
  Top 0.203: R5.1 31.66,18.96 | 11.99,19.61 11.35,18.97 11.42,18.97 | 11.42,18.97 11.59,18.97 11.99,19.37 | 11.99,19.37 11.99,19.13 11.91,19.05 12.06,19.05 12.62,19.61 13.26,18.97 13.02,18.97 12.7,19.29 12.7,19.05 | 11.99,19.37 12.25,19.37 Z5.C | 11.42,18.97 11.35,18.96
  Top 0.279: 31.66,18.96 11.35,18.96 arc-90 10.72,19.6 10.72,19.76 arc90 9.68,20.8 8.73,20.8 arc90 8.02,20.87 U$6.D-
DPLUS
  Top 0.203: R6.1 32.51,20.15 | 11.99,17.86 11.35,18.49 11.59,18.49 12.06,18.02 12.06,18.18 11.91,18.34 12.06,18.34 | 12.06,18.34 12.14,18.34 12.62,17.86 13.18,18.41 13.02,18.41 12.7,18.1 12.7,18.26 12.78,18.34 | Z6.C 12.06,18.41 | 12.06,18.41 12.06,18.49 | 12.06,18.41 12.06,18.34
  Top 0.279: 32.46,20.88 32.46,18.7 32.26,18.49 12.06,18.49 11.27,18.49 arc-90 10.24,19.53 arc90 9.52,20.16 8.81,20.16 arc-90 8.72,20.07 U$6.D+
  Top 0.305: 32.46,20.88 32.37,20.97 R6.1
EESCL
  Top 0.178: 16.14,24.13 R11.1 16.08,24.8 15.8,25.08 14.21,25.08 14.05,24.92 14.05,23.89 13.65,23.5 13.34,23.5 13.18,23.34 13.18,23.02 13.34,22.86 IC4.1
  Top 0.203: IC2.15 22.02,22.34 21.67,21.99 19.61,21.99 18.1,23.5 17.78,23.5 17.15,24.13 16.14,24.13
EESDA
  Top 0.203: IC2.16 22.52,22.05 21.83,21.35 20.08,21.35 20.08,20.88 20.1,20.89 R12.1 20.08,21.21 20.08,20.48 19.81,20.24 15.88,20.24 15.16,20.96 IC4.3
GND  (via drill 0.3, 0.41, 0.6, 0.61, 0.91)
  Top 0.178: C11.1 v30.7,27.64 | 27.52,24.68 IC2.P$15 IC2.EPAD | 23.02,24.68 IC2.P$12 IC2.EPAD | 24.02,25.68 IC2.EPAD | 24.52,27.68 IC2.EPAD | 23.52,28.68 IC2.EPAD | C10.1 27.18,21.61 27.3,21.73 27.3,22.16 27.52,22.38 IC2.26 | 18.67,24.1 v18.69,24.08 | C18.2 36.81,18.1 | 36.81,18.1 C21.2 | v35.72,18.18 35.8,18.1 36.81,18.1 | C33.2 v13.81,35.48 14.52,36.18 C32.2 | C30.2 v59.08,14.29 58.42,13.62 58.42,13.57 57.76,13.57 C29.2 | R14.1 23.72,34.29 22.23,34.29 21.19,33.26 C7.1 | IC4.2 13.02,21.91 v12.3,22.62 | Z3.A 15.35,28.5 v16.34,27.51
  Top 0.203: Z5.A 12.32,21.73 v12.3,22.62 | C16.2 62.77,23.59 v63.5,22.86 | LED1.C 78.06,13.29 77.47,12.7 74.49,12.7 | LED2.C 77.82,38.38 69.22,46.99 66.48,46.99 | LED5.C 29.73,10.86 S2.3
  Top 0.254: C22.1 59.05,35.39 59.05,34.85 58.9,34.69 58.58,34.69 58.42,34.53 58.42,33.81 56.66,32.05 IC1.87 | v57.12,18.02 57.15,18.02 57.15,18.26 58.26,19.37 58.26,19.76 IC1.64 55.48,22.54 v55.32,22.46 | IC1.66 56.41,23.02 v56.04,23.02 | 58.8,18.13 C19.1 | v52.29,15.16 51.82,14.69 C17.1
  Top 0.279: 44.45,19.92 44.45,20.54 IC1.38
  Top 0.305: 7.22,42.56 R3.1 | C4.1 7.22,42.56 | 7.22,42.56 7.06,42.55 6.92,42.69 v6.92,44.05 | IC1.10 46.99,32.44 v46.99,32.23 | IC1.14 45.72,30.88 | IC1.13 45.72,31.59 | 45.72,31.59 45.72,30.88 | IC1.12 45.72,32.3 45.72,31.59 | 45.72,30.88 v45.72,30.83 | C1.1 32.89,30.35 v33.31,30.37 | C12.1 v30.94,32.23 | IC2.41 28.02,29.68 IC2.P$4 | IC2.26 27.52,24.68 | IC2.12 23.02,24.68 | IC2.10 24.02,25.68 | IC2.6 24.52,27.68 | IC2.53 23.52,28.68 | C10.1 26.66,20.84 v26.67,20.51 | C9.1 18.67,24.1 | C6.2 v16.34,27.51 | C7.1 21.11,32.38 21.11,32.54 v19.88,32.54 19.76,32.46 19.76,31.2 C5.2 | v46.1,23.08 46.1,22.18 IC1.38 | C15.1 v38.86,28.29 | C25.2 60.55,34.51 v60.55,35.34 | 44.45,19.92 44.21,19.69 44.21,19.61 44.45,19.37 44.5,19.18 C24.2 | C17.1 51.07,14.69 | C20.1 57.01,18.18 v57.12,18.02 | v58.04,17.49 58.67,18.13 58.8,18.13 | C14.2 50.91,38.45 51.28,38.81 51.63,38.81 v52.23,38.18 | C8.1 24.27,20.46 v24.29,20 | Z6.A 10.48,16.67 v10.24,16.59 | IC2.14 22.02,23.68 IC2.P$12 | IC2.28 28.52,23.68 IC2.P$15 | IC2.56 22.02,30.18 IC2.P$7 | Z1.A 13.26,39.13 v12.94,39.45 | C2.2 25.34,13.75 v24.77,13.18 | Z2.A 12.54,22.86 v12.3,22.62 11.43,23.5 11.43,24.77 11.19,25 Z4.A
  Top 0.406: C22.1 59.69,35.4 v60.55,35.34 | 74.49,12.7 JP1.2 | 66.48,46.99 JP5.2 | U$5.GND 8.02,32.28
  Top 0.61: 10.24,16.75 v10.24,16.59 | 9.05,18.26 7.86,18.26 U$6.GND
  Top 0.813: 8.02,32.28 9.58,32.28 v10.16,32.86 | 10.24,16.75 9.52,17.46 9.52,17.78 9.05,18.26
  Top 0.914: C3.2 v19.37,14.84 | U$1.3 24.05,10.8 24.13,10.87 v24.37,11.03 | C23.2 v18.89,7.38 18.81,7.38 17.78,6.35 13.34,6.35 12.38,7.3 | JP6.1 7.78,9.05 10.24,9.05 11.03,8.25 D3.A 12.38,8.18 12.38,7.3 | 12.3,7.38 12.38,7.3
  Top 1.016: 10.16,32.54 v10.16,32.86
  Route2 0.254: v55.32,22.46 55.32,22.7 | v56.04,23.02 56.04,23.18
  Route2 0.305: v24.77,13.18 24.77,11.35
  Route2 0.61: v19.37,14.84 19.37,15.24
  Route2 0.914: v24.37,11.03 24.69,11.27 24.77,11.35
  Bottom 0.178: v13.81,35.48 14.21,35.08
  pour Route2: 0,53.34 88.9,53.34 88.9,0 0,0
KXI
  Top 0.178: IC1.56 54.36,18 55.44,18 Y3.P$2 57.24,16.21 C30.1
KXO
  Top 0.178: IC1.55 54.48,17.17 54.48,16.86 54.99,16.35 | 54.99,16.35 54.99,16.22 56.13,15.08 56.26,15.08 C29.1 | 54.99,16.35 55.03,16.32 Y3.P$1
MXI
  Top 0.178: 42.15,11.03 Y4.2 | C21.1 38.27,17.14 38.73,17.14 41.91,13.97 | 41.91,13.97 41.91,13.98 41.92,13.98 43.82,15.88 43.82,16.36 IC1.43 | 41.91,12.07 41.91,13.97
  Top 0.406: Y4.2 41.91,12.07
MXO
  Top 0.178: IC1.42 42.86,16.11 | C18.1 38.97,19.05 39.37,18.65 39.61,18.65 40.08,19.13 40.16,19.13 40.32,18.97 40.32,17.7 40.48,17.54 40.72,17.54 41.59,18.41 41.75,18.41 42.07,18.1 42.07,17.22
  Top 0.305: 42.86,16.11 Y4.1 42.07,16.35 42.07,17.22
N$1
  Top 0.178: 30.93,30.18 C1.2
  Top 0.305: IC2.42 30.93,30.18 | C1.2 R1.1
N$2
  Top 0.61: 12.19,11.08 arc90 D1.A
  Top 0.813: JP6.2 12.19,11.08
  Top 0.914: 12.53,11.43 D1.A
  cutout Route15: 19.05,31.12 19.05,33.02 20.95,34.93 20.95,36.83 19.69,38.1 15.88,38.1 14.6,36.83 14.6,35.56 13.97,34.93 12.7,34.93 12.06,34.29 12.06,30.48 13.34,29.21 16.19,29.21 17.22,28.18 17.38,28.18 17.78,28.57 17.78,29.84
N$3
  cutout Route2: 13.34,29.21 16.19,29.21 17.22,28.18 17.38,28.18 17.78,28.57 17.78,29.84 19.05,31.12 19.05,33.02 20.95,34.93 20.95,36.83 19.69,38.1 15.88,38.1 14.6,36.83 14.6,35.56 13.97,34.93 12.7,34.93 12.06,34.29 12.06,30.48
N$4
  cutout Route2: 38.1,16.51 38.1,18.41 38.73,19.05 45.72,19.05 46.35,18.41 46.35,10.16 43.82,7.62 40.64,7.62 39.37,8.89 39.37,15.24
N$5
  Top 0.178: R2.1 29.86,34.91 29.59,35.18 28.07,35.18 27.81,34.93 27.81,32.51 27.94,32.38 27.94,31.12 28.02,31.03 IC2.44
N$6
  cutout Route15: 38.1,18.41 38.73,19.05 45.72,19.05 46.35,18.41 46.35,10.16 43.82,7.62 40.64,7.62 39.37,8.89 39.37,15.24 38.1,16.51
N$7
  Top 0.305: IC1.63 57.32,19.99 C20.2
N$8
  Top 0.254: 34.21,20.88 33.99,20.82 R6.2
  Top 0.279: IC1.35 42.67,20.88 34.21,20.88
N$9
  Top 0.279: IC1.36 42.9,20.4 35.02,20.4 34.47,19.84 33.34,19.84 33.42,19.76 33.42,19.37 33.41,19.37 R5.2
N$10  (via drill 0.3)
  other vias: 1.27,12.07
N$11
  Top 0.203: R7.1 71.54,18.47 75.17,14.84 76.07,14.84 LED1.A
N$12
  Top 0.203: R8.1 LED2.A
N$13
  Top 0.305: C2.1 24.04,13.88 23.49,13.34 U$1.1
N$14  (via drill 0.3)
  other vias: 2.54,12.07
N$15
  Top 0.203: IC2.52 24.02,32.44 24.29,32.7 24.84,32.7 25.32,33.18 25.32,33.96 R14.2 | R14.2 25.4,34.29 | R13.1 24.86,35.55 25.32,35.08 25.32,33.99 R14.2
N$16  (via drill 0.3)
  other vias: 3.81,12.07
N$17  (via drill 0.3)
  other vias: 5.08,13.89
N$18
  Top 0.203: R18.1 30.25,14.38 29.84,13.97 29.84,13.39 LED5.A
N$19  (via drill 0.3)
  other vias: 5.08,12.62
N$20  (via drill 0.3)
  other vias: 5.08,7.62
N$21  (via drill 0.3)
  other vias: 5.08,6.27
N$22  (via drill 0.3)
  other vias: 3.81,8.1
N$23  (via drill 0.3)
  other vias: 2.54,8.1
N$24  (via drill 0.3)
  other vias: 1.27,8.1
P00
  Top 0.203: IC1.71 63.5,19.47 63.5,17.14 61.6,15.24 61.6,8.89 62.91,7.58
  Top 0.406: 62.91,7.58 JP1.10
P01
  Top 0.203: 62.23,10.6 62.23,15.24 63.98,16.99 63.98,19.7 IC1.72
  Top 0.406: JP1.9 62.23,10.6
P02
  Top 0.203: IC1.73 64.45,19.93 64.45,16.67 63.02,15.24 63.02,11.59 65.24,9.37
  Top 0.406: 65.24,9.37 JP1.8
P03
  Top 0.203: IC1.74 64.93,20.16 64.93,15.88 63.82,14.76 63.82,12.86 | 65.25,11.43 JP1.7
  Top 0.406: 63.82,12.86 65.25,11.43
P04
  Top 0.203: IC1.76 60.01,27.61 60.01,27.15 61.12,26.04 61.6,26.04 65.41,22.23 65.41,15.24 64.77,14.61 64.77,13.49 67.1,11.17
  Top 0.406: 67.1,11.17 JP1.6
P05
  Top 0.203: IC1.77 60.75,29.05 62.23,29.05 63.18,28.1 63.18,26.51 65.88,23.81 65.88,14.29 | 67.05,13.12 JP1.5
  Top 0.406: 65.88,14.29 67.05,13.12
P06
  Top 0.203: 68.79,12.96 66.44,15.32 66.44,23.89 63.66,26.67 63.66,28.26 62.39,29.53 60.51,29.53 IC1.78
  Top 0.406: JP1.4 68.79,12.96
P07
  Top 0.203: IC1.79 60.28,30 62.55,30 64.13,28.42 64.13,26.83 67.15,23.81 67.15,16.35 | 68.74,14.76 JP1.3
  Top 0.406: 67.15,16.35 68.74,14.76
P12  (via drill 0.3)
  Top 0.203: IC1.22 39.52,31.43 v38.58,31.43 | v35.08,36.67 27.94,43.81 12.06,43.81 11.19,44.69
  Top 0.406: 11.19,44.69 11.19,47.23 JP9.4
  Bottom 0.203: v38.58,31.43 38.58,33.18 v35.08,36.67
  Bottom 0.406: JP9.4 10.16,49.78 JP7.4
P14  (via drill 0.3)
  Top 0.203: IC1.24 39.69,29.84 38.1,29.84 v36.2,31.75 | v33.18,36.99 26.99,43.18 11.43,43.18 8.64,45.97
  Top 0.406: 8.64,45.97 8.64,47.24 JP9.3
  Bottom 0.203: v36.2,31.75 36.2,33.97 v33.18,36.99
  Bottom 0.406: JP7.3 8.64,49.28 JP9.3
P15  (via drill 0.3)
  Top 0.203: IC1.25 39.62,29.21 37.46,29.21 36.2,30.48 v35.56,30.48 | v31.75,36.83 26.03,42.55 v10.16,42.55
  Bottom 0.203: v35.56,30.48 34.92,31.12 34.92,33.66 v31.75,36.83 | v10.16,42.55 10.16,44.45 8.25,46.36 6.35,46.36
  Bottom 0.406: JP7.1 3.56,49.28 JP9.1 4.45,46.36 6.35,46.36
P16  (via drill 0.3)
  Top 0.203: IC1.27 40.27,24.13 38.73,24.13 34.92,27.94 v33.66,27.94
  Bottom 0.203: v33.66,27.94 33.02,27.3 33.02,20.96 33.66,20.32 33.66,6.35 33.02,5.72 31.75,5.72 30.48,4.45
  Bottom 0.406: 30.48,4.45 ANALOG.1
P17  (via drill 0.3)
  Top 0.203: IC1.28 40.47,23.62 38.53,23.62 35.08,27.08 v34.24,27.08
  Bottom 0.203: v34.24,27.08 34.06,27.08 33.58,26.59 33.58,21.03 34.21,20.4 34.21,5.64 33.02,4.45
  Bottom 0.406: 33.02,4.45 ANALOG.2
P20
  Top 0.203: IC1.95 56.43,37.47 61.6,37.47 64.13,34.93 71.12,34.93 72.44,36.24
  Top 0.406: 72.44,36.24 JP5.10
P21
  Top 0.203: IC1.96 56.2,37.94 61.75,37.94 63.98,35.72 69.53,35.72 | 70.6,36.79 JP5.9
  Top 0.406: 69.53,35.72 70.6,36.79
P22
  Top 0.203: IC1.97 55.97,38.42 62.07,38.42 63.98,36.51 68.58,36.51 70.64,38.57
  Top 0.406: 70.64,38.57 JP5.8
P23
  Top 0.203: IC1.98 55.9,39.05 62.55,39.05 64.13,37.47 67.63,37.47 | 68.74,38.58 JP5.7
  Top 0.406: 67.63,37.47 68.74,38.58
P24
  Top 0.203: IC1.99 55.67,39.53 62.87,39.53 64.13,38.26 66.68,38.26 68.84,40.43
  Top 0.406: 68.84,40.43 JP5.6
P25
  Top 0.203: IC1.1 48.74,37.06 48.74,37.94 50.8,40.01 63.18,40.01 63.98,39.21 65.88,39.21
  Top 0.406: 65.88,39.21 JP5.5
P26
  Top 0.203: IC1.2 48.26,36.83 48.26,38.1 50.64,40.48 65.41,40.48 67.05,42.12
  Top 0.406: 67.05,42.12 JP5.4
P27
  Top 0.203: IC1.3 47.78,36.6 47.78,38.26 50.48,40.96 61.67,40.96 62.87,42.15 | 65.09,42.15 65.19,42.17 JP5.3
  Top 0.406: 62.87,42.15 65.09,42.15
P30
  Top 0.203: IC1.44 45.09,16.93 45.09,10.16
  Top 0.406: 45.09,10.16 JP3.10
P31
  Top 0.203: IC1.45 45.72,16.85 45.72,12.07
  Top 0.406: 45.72,12.07 JP3.9
P32
  Top 0.203: IC1.46 46.35,16.78 46.35,12.7 47.62,11.43 48.26,11.43 49.53,10.16 49.53,8.25
  Top 0.406: 49.53,8.25 JP3.8
P33
  Top 0.203: 50.8,11.27 50.56,11.51 48.82,11.51 46.99,13.34 46.99,16.71 IC1.47
  Top 0.406: JP3.7 50.8,11.27
P34
  Top 0.203: IC1.48 47.62,16.64 47.62,14.61 50.16,12.07 51.43,12.07 52.07,11.43 52.07,8.25
  Top 0.406: 52.07,8.25 JP3.6
P35
  Top 0.203: 53.34,11.43 52.07,12.7 50.16,12.7 48.26,14.61 48.26,16.57 IC1.49
  Top 0.406: JP3.5 53.34,11.43
P36
  Top 0.203: IC1.51 54.61,14.22 54.61,8.25
  Top 0.406: 54.61,8.25 JP3.4
P37
  Top 0.203: IC1.52 55.88,13.65
  Top 0.406: 55.88,13.65 JP3.3
P40  (via drill 0.3)
  Top 0.203: v56.99,25.08 56.99,24.56 IC1.69
  Bottom 0.203: 71.12,19.69 68.98,19.69 63.1,25.56 57.47,25.56 v56.99,25.08
  Bottom 0.406: JP2.10 71.12,19.69
P41  (via drill 0.3)
  Top 0.203: v58.42,27.3 57.79,26.67 57.79,24.48 IC1.70
  Bottom 0.203: v58.42,27.3 62.07,27.3 68.82,20.56 69.45,20.56
  Bottom 0.406: 69.45,20.56 JP2.9
P42
  Top 0.203: 71.75,22.86 68.9,22.86 66.83,24.92 66.83,25.56 64.61,27.78 64.61,28.57 62.71,30.48 60.05,30.48 IC1.80
  Top 0.406: JP2.8 71.75,22.86
P43
  Top 0.203: IC1.81 59.82,30.96 62.87,30.96 65.09,28.73 65.09,27.94 68.9,24.13
  Top 0.406: 68.9,24.13 JP2.7
P44
  Top 0.203: IC1.82 59.59,31.43 63.02,31.43 65.56,28.89 65.56,28.1 68.26,25.4 71.75,25.4
  Top 0.406: 71.75,25.4 JP2.6
P45
  Top 0.203: IC1.83 59.36,31.91 63.18,31.91 66.04,29.05 66.04,28.42 67.63,26.83 68.26,26.83 68.5,26.59 | 70.33,26.59 70.33,26.83 JP2.5
  Top 0.406: 68.5,26.59 70.33,26.59
P46
  Top 0.203: IC1.84 59.13,32.38 63.34,32.38 67.79,27.94 71.75,27.94
  Top 0.406: 71.75,27.94 JP2.4
P47
  Top 0.203: IC1.85 58.9,32.86 64.29,32.86 67.94,29.21
  Top 0.406: 67.94,29.21 JP2.3
P50
  Top 0.203: IC1.16 28.84,46.36 22.23,46.36 21.34,47.24
  Top 0.406: 21.34,47.24 JP9.8
  Bottom 0.406: JP7.8 21.34,49.28 JP9.8
P51
  Top 0.203: IC1.17 28.76,45.72 19.69,45.72 18.8,46.61
  Top 0.406: 18.8,46.61 18.8,47.24 JP9.7
  Bottom 0.406: JP7.7 18.8,49.28 JP9.7
P52
  Top 0.203: IC1.18 28.69,45.09 17.78,45.09 16.26,46.61
  Top 0.406: 16.26,46.61 16.26,47.24 JP9.6
  Bottom 0.406: JP7.6 16.26,49.28 JP9.6
P53
  Top 0.203: IC1.19 28.62,44.45 15.88,44.45 13.72,46.61
  Top 0.406: 13.72,46.61 13.72,47.24 JP9.5
  Bottom 0.406: JP9.5 12.7,49.78 JP7.5
P54  (via drill 0.3)
  Top 0.203: IC1.31 41.91,22.94 38.34,22.94 35.32,25.96 v34.45,25.96
  Bottom 0.203: v34.45,25.96 34.21,25.72 34.21,21.03 34.92,20.32 34.92,5.08 35.56,4.45
  Bottom 0.406: 35.56,4.45 ANALOG.3
P55  (via drill 0.3)
  Top 0.203: IC1.32 42.14,22.46 38.1,22.46 35.88,24.69 v35.24,24.69
  Bottom 0.203: 38.1,5.08 35.56,7.62 35.56,16.51 36.83,17.78 36.83,19.29 34.69,21.43 34.69,24.37 35,24.69 v35.24,24.69
  Bottom 0.254: v35.24,24.69 35.24,24.77
  Bottom 0.406: 38.1,5.08 ANALOG.4
P56  (via drill 0.3)
  Top 0.203: IC1.33 42.37,21.99 37.46,21.99 v35.96,23.5
  Bottom 0.203: 40.64,5.08 40.01,5.72 38.73,5.72 36.2,8.25 36.2,15.88 37.46,17.14 37.46,19.53 35.24,21.75 35.24,22.78 v35.96,23.5
  Bottom 0.406: ANALOG.5 40.64,5.08
P57  (via drill 0.3)
  Top 0.203: IC1.34 42.6,21.51 36.75,21.51 v36.04,22.23
  Bottom 0.203: 43.18,4.45 40.01,7.62 40.01,22.86 39.37,23.5 37.31,23.5 v36.04,22.23
  Bottom 0.406: ANALOG.6 43.18,4.45
P60  (via drill 0.3)
  Top 0.203: IC1.89 54.61,31.4 v54.61,31.12
  Bottom 0.203: 59.85,44.93 59.85,42.7 56.75,39.61 56.75,38.02 54.37,35.64 54.37,32.07 54.61,31.83 v54.61,31.12
  Bottom 0.406: JP4.10 59.85,44.93
P61  (via drill 0.3)
  Top 0.203: v51.91,30.48 52.23,30.16 52.71,30.16 53.18,30.64 53.18,30.68 IC1.90
  Bottom 0.203: 58.42,42.55 56.2,40.32 56.2,38.42 53.82,36.04 53.82,33.02 51.91,31.12 v51.91,30.48
  Bottom 0.406: JP4.9 58.42,42.55
P62  (via drill 0.3)
  Top 0.203: IC1.91 53.54,31.75 52.07,31.75 v51.75,32.07
  Bottom 0.203: v51.75,32.07 51.75,32.54 52.07,32.86 52.55,32.86 53.18,33.5 53.18,36.51 55.56,38.89 55.56,41.43 57.15,43.02 57.15,45.09
  Bottom 0.406: 57.15,45.09 JP4.8
P63  (via drill 0.3)
  Top 0.203: v52.07,33.66 52.07,33.02 52.71,32.38 53.47,32.38 IC1.92
  Bottom 0.203: 54.61,42.55 54.61,38.73 52.71,36.83 52.71,34.29 v52.07,33.66
  Bottom 0.406: JP4.7 54.61,42.55
P64
  Top 0.203: IC1.6 46.99,35.27 46.99,38.42 50.01,41.43 54.13,41.43 54.61,41.91 54.61,45.24 | 53.5,46.36 JP4.6
  Top 0.406: 54.61,45.24 53.5,46.36
P65
  Top 0.203: IC1.7 46.51,35.04 46.51,38.73 49.69,41.91 52.71,41.91 53.34,42.55
  Top 0.406: 53.34,42.55 JP4.5
P66
  Top 0.203: 52.07,45.09 52.07,43.02 51.43,42.39 49.53,42.39 46.04,38.89 46.04,34.81 IC1.8
  Top 0.406: JP4.4 52.07,45.09
P67
  Top 0.203: IC1.9 45.56,34.58 45.56,43.02 47.62,45.09 49.53,45.09
  Top 0.406: 49.53,45.09 JP4.3
P120  (via drill 0.3)
  Top 0.203: IC1.53 50.16,20.07 v50.16,24.13
  Bottom 0.203: v50.16,24.13 48.26,26.04 48.26,32.38 43.18,37.47
  Bottom 0.406: JP8.8 JP10.8 43.18,37.47
P121  (via drill 0.3)
  Top 0.203: IC1.54 51.43,19.51 v51.43,21.59
  Bottom 0.178: 46.99,30.8 46.99,31.12 44.45,33.66 44.45,35.24 42.55,37.15 42.55,44.29 40.64,46.2
  Bottom 0.203: v51.43,21.59 46.99,26.04 46.99,30.8
  Bottom 0.406: JP8.7 JP10.7 40.64,46.2
P122  (via drill 0.3)
  Top 0.203: IC1.67 54.74,25.4 v53.98,25.4 | v50.16,27.3 48.9,28.57 v45.72,28.57
  Bottom 0.178: 44.45,32.38 44.45,33.02 43.82,33.66 43.82,34.93 41.91,36.83 41.91,43.81 40.01,45.72 38.73,45.72 38.1,46.36
  Bottom 0.203: v53.98,25.4 52.07,27.3 v50.16,27.3 | v45.72,28.57 44.45,29.84 44.45,32.38
  Bottom 0.406: JP8.6 JP10.6 38.1,46.36
P123  (via drill 0.3)
  Top 0.203: IC1.68 54.61,26.24 v54.61,26.67 | v50.16,29.21 49.53,29.84 45.72,29.84 v44.45,28.57
  Bottom 0.178: 43.82,31.75 43.82,33.02 43.18,33.66 43.18,34.93 41.27,36.83 41.27,43.81 40.01,45.09 36.83,45.09 35.56,46.36
  Bottom 0.203: v54.61,26.67 52.07,29.21 v50.16,29.21 | v44.45,28.57 43.82,29.21 43.82,31.75
  Bottom 0.406: JP8.5 JP10.5 35.56,46.36
P124  (via drill 0.3)
  Top 0.178: v46.35,45.72 33.66,45.72 33.02,46.36
  Top 0.203: IC1.4 50.02,33.66 v50.16,33.66
  Top 0.406: 33.02,46.36 JP10.4
  Bottom 0.203: v50.16,33.66 46.35,37.47 v46.35,45.72
  Bottom 0.406: JP8.4 JP10.4
P125  (via drill 0.3)
  Top 0.178: v44.85,44.69 32.78,44.69 31.12,46.36
  Top 0.203: v49.53,31.75 48.82,32.46 48.82,34.15 IC1.5
  Top 0.406: 31.12,46.36 30.48,46.99 JP10.3
  Bottom 0.203: v44.85,44.69 45.72,43.81 45.72,36.2 49.53,32.38 v49.53,31.75
  Bottom 0.406: JP8.3 JP10.3
P126  (via drill 0.3)
  Top 0.203: IC1.29 44.45,26.9 v44.45,27.3
  Bottom 0.178: 42.55,31.75 42.55,34.93 40.64,36.83 40.64,43.81 40.01,44.45 36.2,44.45 34.92,45.72 28.58,45.72 27.94,46.36
  Bottom 0.203: 42.55,31.75 42.55,29.21 v44.45,27.3
  Bottom 0.406: JP8.2 JP10.2 27.94,46.36
P127  (via drill 0.3)
  Top 0.203: IC1.30 43.66,25.4 v44.45,25.4
  Bottom 0.178: 41.91,31.12 41.91,34.93 40.01,36.83 40.01,43.18 39.37,43.81 36.2,43.81 34.92,45.09 26.67,45.09 25.4,46.36
  Bottom 0.203: v44.45,25.4 44.45,26.04 41.91,28.57 41.91,31.12
  Bottom 0.406: JP8.1 JP10.1 25.4,46.36
P154
  Top 0.203: IC1.93 56.89,36.51 61.12,36.51 63.66,33.97 73.42,33.97 75.56,31.83 75.56,20.32 74.61,19.37 73.18,19.37 R7.2
P155
  Top 0.203: IC1.94 56.66,36.99 61.36,36.99 63.9,34.45 71.52,34.45 71.91,34.85 72.76,34.85 R8.2
SHIELD
  Top 0.305: R3.2 C4.2 6.98,39.26 U$5.MTN2 | 2.54,38.88 U$5.MTN1 | 1.57,29.54 1.57,28.88 1.27,28.57 1.27,24.81 U$6.MTN1
  Top 0.61: U$5.MTN2 U$5.MTN1 1.27,37.61 1.27,29.84 1.57,29.54 U$5.MTN3 | U$6.MTN2 U$6.MTN1 U$6.MTN3 U$6.MTN4
SWDCK  (via drill 0.3)
  Top 0.203: IC2.46 27.02,32.19 26.91,32.31 26.91,36.04 v28.02,37.15 | v31.51,34.13 37.52,34.13 IC1.21
  Bottom 0.203: v28.02,37.15 28.5,37.15 v31.51,34.13
SWDIO
  Top 0.203: IC2.45 27.52,32.25 27.38,32.38 27.38,35.16 27.86,35.64 36.72,35.64 IC1.20
SWO  (via drill 0.3)
  Top 0.203: IC2.47 26.52,36.92 27.54,37.94 29.37,37.94 30.48,36.83 30.56,36.67 v30.64,36.59 | v33.97,33.26 36.98,33.26 37.46,32.78 37.46,31.12 38.1,30.48 39.76,30.48 IC1.23
  Bottom 0.203: v30.64,36.59 v33.97,33.26
VBUS1
  Top 0.178: 10.79,41.27 10.72,40.57 D2.A
  Top 0.203: R13.2 22.86,38.1 19.05,41.91 13.34,41.91 12.06,40.64 D2.A
  Top 0.305: Z1.C 11.76,39.84 11.51,40.08 11.11,40.08 D2.A
  Top 0.61: 9.13,35.8 7.86,35.8 7.7,35.72 U$5.VBUS 7.7,35.64
  Top 0.813: 9.13,35.8 10.16,36.83 10.16,37.47 10.55,37.86 D2.A
VBUS2  (via drill 0.61)
  Top 0.305: v10.32,21.91 10.4,22.06 Z4.C
  Top 0.61: v14.13,14.45 13.81,14.42 | 10.08,21.67 v10.32,21.91 | U$6.VBUS 7.64,21.72 7.62,21.75
  Top 0.813: 13.81,14.42 D5.A | 7.62,21.75 10,21.75 10.08,21.67
  Bottom 0.813: v14.13,14.45 14.13,16.99 10.32,20.8 v10.32,21.91
VCCD
  Top 0.305: C25.1 58.55,33.22 IC1.86 54.54,29.21 53.98,29.21 51.56,26.96 50.29,25.67 IC1.39
VDD  (via drill 0.3, 0.61, 0.91)
  Top 0.178: 28.56,30.77 IC2.43 | 28.56,32.62 v28.58,33.32 28.56,32.65 | 30.55,25.18 C11.2 30.75,25.26 30.75,24.1 v31.08,23.77 | 28.02,21.91 C10.2 | 23.02,21.74 C8.2 | 20.24,25.18 C9.2 20.03,25.29 | IC4.5 | 14.92,23.93 R11.2
  Top 0.203: R12.2 18.77,21.88 18.41,22.23 17.86,22.23 | 16.99,22.86 17.62,22.23 17.86,22.23 | 16.91,22.94 16.99,22.86 | 16.99,22.86 17.15,22.86 IC4.5 15.64,22.86 14.92,23.57 14.92,23.93 | 17.86,22.23 18.02,22.38 18,22.4 v17.99,22.4
  Top 0.254: C22.2 57.77,33.85 IC1.88 57.79,33.87 57.79,35.32 57.63,35.48 57.63,34.61 v57.55,34.29 | 60.57,25.25 59.39,26.43 v59.13,26.43 | 43.34,19.96 43.08,19.86 C24.1 43.45,19.96 43.82,20.32 43.82,20.61 IC1.37 | C14.1 51.56,35.92 v51.56,34.77
  Top 0.305: v51.56,34.77 51.56,36.13 IC1.100 52.07,36.67 51.91,36.51 | v41.91,26.51 40.68,25.28 | 40.68,25.28 IC1.26 | C16.1 61.36,24.86 60.96,24.86 60.57,25.25 IC1.75 | IC1.37 45.09,21.88 v45.09,23.72 | 43.45,20.08 43.26,20 43.34,19.96 | C17.2 50.93,17.11 v50.29,17.75 50.15,17.75 IC1.50 | C6.1 v19.8,27.51 20.12,27.18 IC2.7 | IC2.3 20.09,29.18 C5.1 19.09,29.58 v18.49,29.62 | R1.2 v33.27,29.05 | 28.56,30.77 C12.2 28.56,32.62 | R2.2 28.56,32.65 | IC2.32 30.55,25.18 | IC2.27 28.02,21.91 | C10.2 27.95,20.65 v27.94,20.51 | C8.2 22.97,20.84 v22.99,20.11 | IC2.17 23.02,21.74 | 20.52,24.18 20.03,24.67 | 20.03,24.67 20.03,25.29 | IC2.11 20.24,25.18 | 20.03,24.67 v20.03,24 arc-90 20.37,24.18 IC2.13 | 22.52,31.75 IC2.55 22.52,33.23 v22.48,33.56 | 22.52,31.75 22.52,31.96 22.48,32 | C7.2 22.49,31.78 22.52,31.75 | 40.68,25.28 40.39,24.99 39.24,24.99 38.86,25.37 38.86,25.75 38.73,25.88 38.85,25.88 C15.2 | IC1.65 58.82,19.91 58.93,19.91 59.77,19.07 | 59.77,19.07 59.82,19.02 59.94,19.02 v60.71,18.26 | 59.77,19.07 C19.2
  Top 0.406: C24.1 43.45,19.99 | U$1.6 U$1.5
  Top 0.61: D7.A 24.99,16.92 v26.35,16.91 27.34,15.92 R18.2
  Top 0.914: U$1.5 26.03,9.52 25.4,8.89 v25.4,8.1 24.69,7.38 C23.1
  Route15 0.178: v19.8,27.51 20.19,27.3
  Route15 0.254: v59.13,26.43 59.05,26.43
  pour Route15 (rank 2): 88.9,0 0,0 0,53.34 88.9,53.34
VIN  (via drill 0.61, 0.91)
  Top 0.305: U$1.4 24.69,9.52 25.56,10.4 25.56,12.62 26.27,13.34 U$1.8
  Top 0.61: 15.01,9.83 v15,9.75 | 15.96,40.65 v16.51,40.64 | 16.51,14.72 D5.C
  Top 0.813: D5.C D1.C 15.88,11.35 15.01,10.48 15.01,9.83 | D2.C 15.96,40.65 | D7.C 16.69,16.92 16.51,16.75 16.51,14.72
  Top 0.914: 19.76,9.92 C3.1 19.87,9.52 | 19.76,9.92 19.05,9.92 18.89,9.76 v15,9.75 15,8.5 15.24,8.25 D3.C | U$1.4 19.92,9.52 19.76,9.68 19.76,9.92
  Bottom 0.61: POWER.6 25.4,3.81
  Bottom 0.813: v16.51,40.64 16.51,29.84 14.6,27.94 14.6,19.05 16.51,17.14 16.51,13.41 15,11.9 v15,9.75 15,6.99 16.91,5.08 24.13,5.08 25.4,3.81
XIN
  Top 0.178: IC2.5 21.03,28.18 20.95,28.26 17.46,28.26 16.51,29.21 16.51,32.54 15.88,33.18 15.24,33.18 14.98,32.92 | 14.03,31.86 C33.1
  Top 0.406: 14.98,32.92 Y2.2 14.03,31.86
XOUT
  Top 0.178: IC2.4 21.01,28.68 20.95,28.73 17.62,28.73 17.15,29.21 17.15,30.48 18.41,31.75 18.41,34.37 | 18.41,35.22 18.41,35.3 Y2.1 | 17.32,35.3 C32.1
  Top 0.406: 18.41,34.37 18.41,35.22 | 18.41,35.3 17.32,35.3

### Text on the board
Top: TM | freeSoC Development Kit v1.0 | Released under the Creative Commons Attribution Share-Alike 3.0 License | http://creativecommons.org/licenses/by-sa/3.0 | Design by: Jon Moeller | http://freesoc.net/ | freeSoC is a trademark of moeller.io, LLC, and may only be used with permission
tPlace: 1.4 | 1.2 | 5.3 | 5.2 | 5.1 | 5.0 | P6 | 12.7 | 12.6 | 12.5 | 12.4 | 12.3 | 12.2 | 12.1 | 12.0 | + | + | 7 | 7 | freeSoC | P2 | + | 7 | P4 | + | 7 | P0 | RESET | 7 | + | P3 | 1.6 | 1.7 | 5.4 | 5.5 | 5.6 | 5.7
tNames: 1.5 | GND | - | 6 | 4 | 2 | 0 | - | 5 | 3 | 1 | 6 | 4 | 5 | 2 | 3 | 15.5 | 0 | 1 | - | 6 | 5 | 4 | 3 | 2 | 1 | 0 | - | 6 | 15.4 | 5 | 4 | 1 | 3 | 5 | 3 | 1 | 2 | 0 | 2 | 4 | 6 | - | 0 | RST | 3V3 | GND | VIN
bNames: www.freesoc.net